# Altium schematic sheet OM-02P.SchDoc
size A3
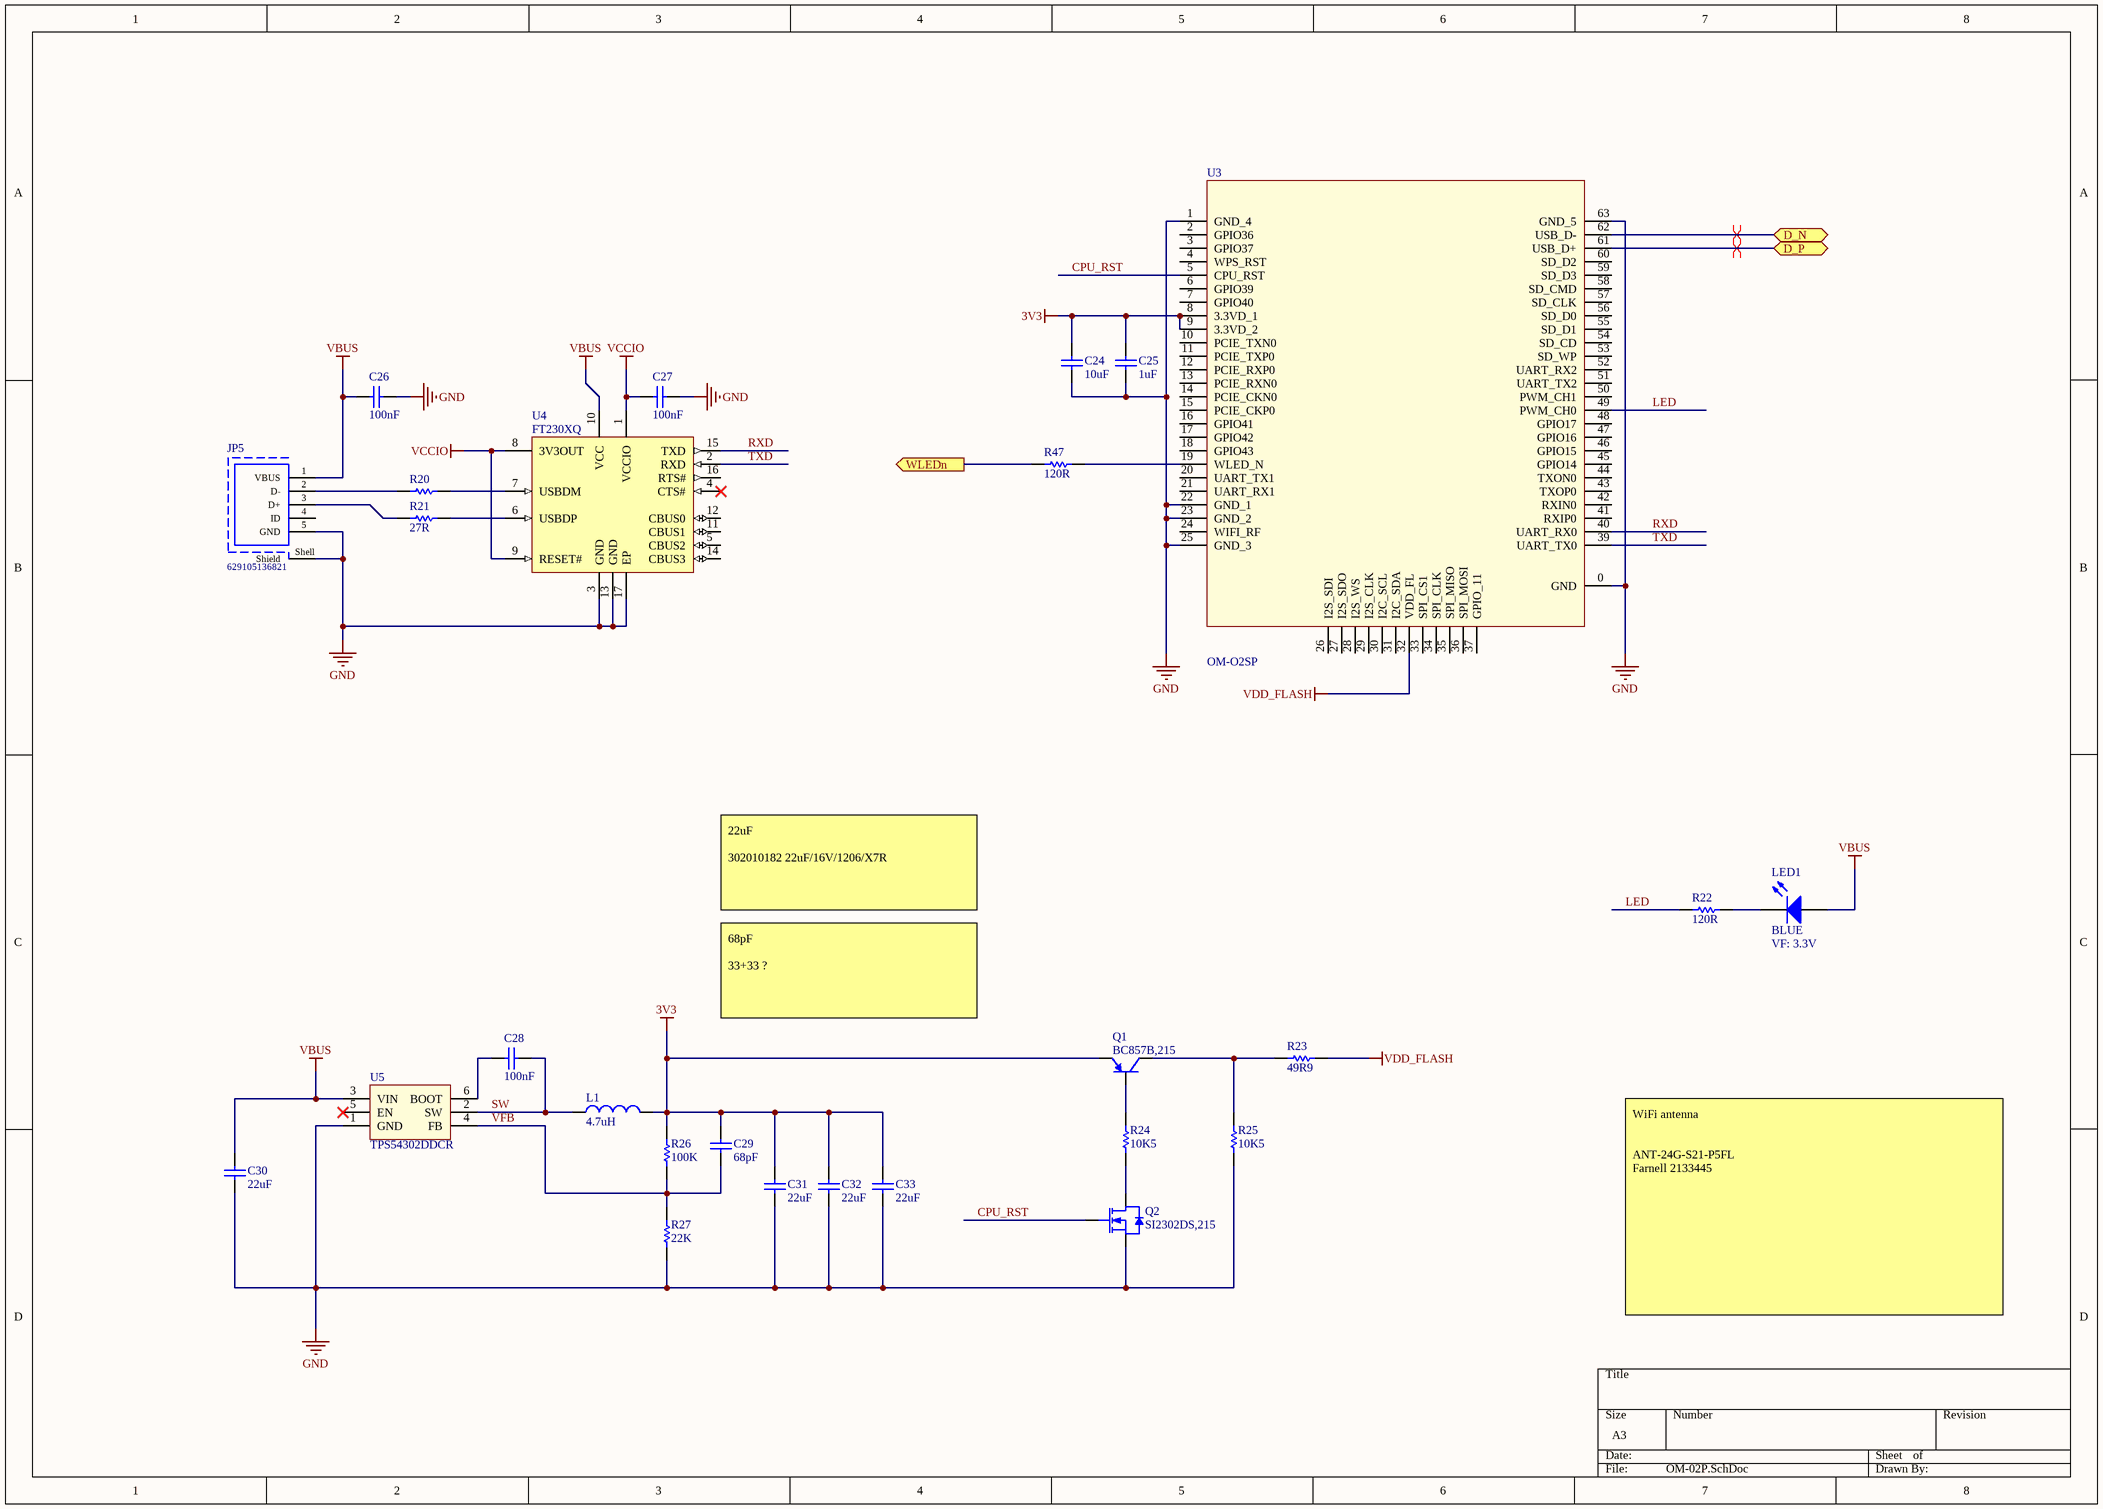
[diagram p0: OM-02P.SchDoc]

## Parts
C24  value 10uF  [CAPC0603(1608)55_L]  (hidden comment: CL10A106MQ8NNNC)
C25  value 1uF  [CAPC0402(1005)33_L]  (hidden comment: GRM155R61C105KA12D)
C26  value 100nF  [CAPC0402(1005)33_L]  (hidden comment: GRM155R61C104KA88D)
C27  value 100nF  [CAPC0402(1005)33_L]  (hidden comment: GRM155R61C104KA88D)
C28  value 100nF  [CAPC0402(1005)33_L]  (hidden comment: GRM155R61C104KA88D)
C29  value 68pF  [CAPC0402(1005)33_L]  (hidden comment: GRM1555C1H680JA01D)
C30  value 22uF  [CAPC1206(3216)75_L]  (hidden comment: CL31A226KOHNNNE)
C31  value 22uF  [CAPC1206(3216)75_L]  (hidden comment: CL31A226KOHNNNE)
C32  value 22uF  [CAPC1206(3216)75_L]  (hidden comment: CL31A226KOHNNNE)
C33  value 22uF  [CAPC1206(3216)75_L]  (hidden comment: CL31A226KOHNNNE)
JP5  629105136821  [629105136821]
L1  value 4.7uH  [L_6045]  (hidden comment: SWPA6045S4R7MT)
LED1  BLUE  VF: 3.3V  [LED_APA3010x]
Q1  BC857B,215  [NXP-SOT23_L]
Q2  SI2302DS,215  [NXP-SOT23_L]
R20  27R  [RESC0402(1005)_L]  (value not drawn)
R21  27R  [RESC0402(1005)_L]
R22  120R  [RESC0402(1005)_L]
R23  49R9  [RESC0402(1005)_L]
R24  10K5  [RESC0402(1005)_L]
R25  10K5  [RESC0402(1005)_L]
R26  100K  [RESC0402(1005)_L]
R27  22K  [RESC0402(1005)_L]
R47  120R  [RESC0402(1005)_L]
U3  OM-O2SP  [CPU-OM-O2S]
U4  FT230XQ  [QFN-16_N]
U5  TPS54302DDCR  [FAIR-MA06A_V]

## Ports
D_N (bidir), D_P (bidir), WLEDn (out)

## Nets
3V3: C24.2 C25.2 C29.2 C31.2 C32.2 C33.2 L1.2 Q1.2(E) R26.2 U3.8(3.3VD_1) U3.9(3.3VD_2)
GND: C24.1 C25.1 C26.2 C27.2 C30.1 C31.1 C32.1 C33.1 JP5.5(GND) JP5.Shell(Shield) Q2.2(S) R25.1 R27.1 U3.0(GND) U3.1(GND_4) U3.22(GND_1) U3.23(GND_2) U3.25(GND_3) U3.63(GND_5) U4.3(GND) U4.13(GND) U4.17(EP) U5.1(GND)
VBUS: C26.1 C30.2 JP5.1(VBUS) LED1.2(A) U4.10(VCC) U5.3(VIN)
VCCIO: C27.1 U4.1(VCCIO) U4.8(3V3OUT) U4.9(RESET#)
VDD_FLASH: R23.2 U3.32(VDD_FL)
CPU_RST: Q2.1(G) U3.5(CPU_RST)
D_N: U3.62(USB_D-) ; port D_N
D_P: U3.61(USB_D+) ; port D_P
LED: R22.1 U3.49(PWM_CH0)
RXD: U3.40(UART_RX0) U4.15(TXD)
SW: C28.2 L1.1 U5.2(SW)
TXD: U3.39(UART_TX0) U4.2(RXD)
VFB: C29.1 R26.1 R27.2 U5.4(FB)
WLEDn: R47.1 ; port WLEDn
NetC28_1: C28.1 U5.6(BOOT)
NetJP5_2: JP5.2(D-) R20.1
NetJP5_3: JP5.3(D+) R21.1
NetLED1_1: LED1.1(K) R22.2
NetQ1_1: Q1.1(B) R24.2
NetQ1_3: Q1.3(C) R23.1 R25.2
NetQ2_3: Q2.3(D) R24.1
NetR20_2: R20.2 U4.7(USBDM)
NetR21_2: R21.2 U4.6(USBDP)
NetR47_2: R47.2 U3.19(WLED_N)

Not connected (* = marked no-connect by the designer): JP5 4(ID); U3 2(GPIO36) 3(GPIO37) 4(WPS_RST) 6(GPIO39) 7(GPIO40) 10(PCIE_TXN0) 11(PCIE_TXP0) 12(PCIE_RXP0) 13(PCIE_RXN0) 14(PCIE_CKN0) 15(PCIE_CKP0) 16(GPIO41) 17(GPIO42) 18(GPIO43) 20(UART_TX1) 21(UART_RX1) 24(WIFI_RF) 26(I2S_SDI) 27(I2S_SDO) 28(I2S_WS) 29(I2S_CLK) 30(I2C_SCL) 31(I2C_SDA) 33(SPI_CS1) 34(SPI_CLK) 35(SPI_MISO) 36(SPI_MOSI) 37(GPIO_11) 41(RXIP0) 42(RXIN0) 43(TXOP0) 44(TXON0) 45(GPIO14) 46(GPIO15) 47(GPIO16) 48(GPIO17) 50(PWM_CH1) 51(UART_TX2) 52(UART_RX2) 53(SD_WP) 54(SD_CD) 55(SD_D1) 56(SD_D0) 57(SD_CLK) 58(SD_CMD) 59(SD_D3) 60(SD_D2); U4 4(CTS#)* 5(CBUS2) 11(CBUS1) 12(CBUS0) 14(CBUS3) 16(RTS#); U5 5(EN)*

## Layout directives
differential pair: D_N, D_P

## Notes on the sheet
- 22uF
  302010182 22uF/16V/1206/X7R
- 68pF
  33+33 ?
- WiFi antenna
  ANT-24G-S21-P5FL
  Farnell 2133445

## Library data of the parts
C24 = CAP_10uF_0603: 0603 10uF ±20% 6.3V X5R H=0.8mm; Voltage: 10V; PackageReference: 0603; MPN: CL10A106MQ8NNNC; Dielectric: X5R
C25 = CAP_1uF_0402: 0402 1μF ±10% 16V X5R; Voltage: 10V; PackageReference: 0402; MPN: GRM155R61C105KA12D; Dielectric: X5R
C26-C28 = CAP_100nF_0402: 0402 100nF ±10% 16V X5R; PackageReference: 0402; MPN: GRM155R61C104KA88D; Voltage: 16V; Dielectric: X5R
C29 = CAP_68pF_0402: 0402 68pF ±5% 50V C0G; PackageReference: 0402; MPN: GRM1555C1H680JA01D; Voltage: 50V; Dielectric: C0G
C30-C33 = CAP_22uF_16V_1206: 1206 22uF ±10% 16V X5R; PackageReference: 1206; MPN: CL31A226KOHNNNE; Voltage: 16V; Dielectric: X5R
JP5 = 629105136821: Micro USB 2.0 Type B Receptacle WR-COM, Horizontal, SMT, with Pads and Pegs; Rated Current: 1 A; Contact Resistance: 30 mOhm; Working Voltage: 30 VAC; ComponentLink1Description: Manufacturer; ComponentLink1URL: http://www.we-online.de; ComponentLink2Description: Datasheet; ComponentLink2URL: https://katalog.we-online.de/em/datasheet/629105136821.pdf; Part Number: 629105136821; Published Date: September 2018; Publisher: Wurth Elektronik; Orientation: Horizontal; Connector Type: Micro USB 2.0 Type B; Operating Temperature: -40 to 105 degC; Mounting Technology: SMT; Gender: Receptacle; Packaging: Tape and Reel; MPN: 629105136821
L1 = L_4.7uH_6045: 6.0*6.0*4.5 4.7μH ±20% 5.50A DCR=0.034 SRF=24MHz; MPN: SWPA6045S4R7MT
LED1 = LED-BLUE-APA3010QBC/D-GX: LED BLUE; VALUE: BLUE; MPN: APA3010QBC/D-GX
Q1 = BC857: PNP,Vce=45V,Ic=0.1A,hfe=220~475; Manufacturer: Infineon; Ptot (max): 330Â mW; fT (typ): 250Â MHz; VCBO (max): 50Â V; ICM (max): 200Â mA; Green: TRUE; VCEO (max): 45Â V; VEBO (max): 5Â V; ICBO (max): 15Â nA; IC (max): 100Â mA; Packing: Reel; ComponentLink2Description: Datasheet; MPN: BC857B,215; PackageReference: SOT23; ComponentLink1URL: http://www.infineon.com/; IBM (max): 200Â mA; PackageDescription: 3-Pin Small Outline Transistor Package, 1.3 x 2.9 mm Body, 0.95 mm Pitch; ComponentLink3URL: http://www.infineon.com/dgdl/SOT23-Package_Overview.pdf?folderId=db3a30431936bc4b0119532290053c66&fileId=db3a30431936bc4b0119533468123c85; ComponentLink3Description: Package Specification; Mounting Technology: Surface Mount; ComponentLink1Description: Manufacturer URL; PackageVersion: Apr-08; Polarity: PNP; ComponentLink2URL: http://www.infineon.com/dgdl/bc857series_bc858series_bc859series_bc860series.pdf?folderId=db3a304314dca389011541d30fa21656&fileId=db3a304314dca389011541da0e3a1661
Q2 = SI2302: N-Channel Enhancement Mode Field-Effect Transistor, 20 V, 2.5 A, 3-Pin SOT23, Tape and Reel; Manufacturer: NXP Semiconductors; MPN: SI2302CDS-T1-GE3; Ciss [typ] (pF): 230; VDS [max] (V): 20; Channel Type: N; Coss [typ] (pF): 125; ID [max] (A): 2.5; Packing: Tape & Reel; DatasheetVersion: Rev. 02; PackageVersion: 06-03-16, 03/2006; Code_JEDEC: TO-236AB; ComponentLink3Description: Package Specification; ComponentLink2URL: http://www.nxp.com/documents/data_sheet/SI2302DS.pdf; PackageDescription: 3-Pin Small Outline Transistor Package, Body 2.9 x 1.3 mm, Pitch 0.95 mm; ComponentLink2Description: Datasheet; ComponentLink1Description: Manufacturer URL; Mounting Technology: Surface Mount; ComponentLink1URL: http://www.nxp.com/; ComponentLink3URL: http://www.nxp.com/documents/outline_drawing/sot023_po.pdf; PackageReference: SOT23
R20 R21 = RES_27R_0402: 0402 27Ω ±1% 1/16W; MPN: RC0402FR-0727RL; Power: 62.5mW; Tolerance: 1%; Value: 27R
R22 R47 = RES_120R_0402: 0402 120Ω ±1% 1/16W; MPN: RC0402FR-07120RL; Power: 62.5mW; Tolerance: 1%; Value: 120R
R23 = RES_49R9_0402: 0402 49.9Ω ±1% 1/16W; MPN: RC0402FR-0749R9L; Power: 62.5mW; Tolerance: 1%; Value: 49R9
R24 R25 = RES_10K5_0402: 0402 10.5KΩ ±1% 1/16W; MPN: RC0402FR-0710K5L; Power: 62.5mW; Tolerance: 1%; Value: 10K5
R26 = RES_100K_0402: 0402 100KΩ ±1% 1/16W; MPN: RC0402FR-07100KL; Power: 62.5mW; Tolerance: 1%; Value: 100K
R27 = RES_22K_0402: 0402 22KΩ ±1% 1/16W; MPN: RC0402FR-0722KL; Power: 62.5mW; Tolerance: 1%; Value: 22K
U3 = CPU-OM-O2SP: Onion Omega2S; MPN: OM-O2SP; Mouser: 353-OM-O2SP
U4 = IC-COM-USB-FT230XQ-SQ17: USB Bridge, USB to UART USB 2.0 UART Interface 16-QFN (4x4); MPN: FT230XQ-R
U5 = TPS54302DDCR: Buck Switching Regulator IC Positive Adjustable 0.596V 1 Output 3A SOT-23-6 Thin, TSOT-23-6; MPN: TPS54302DDCR